# EAGLE schematic MCU board ATmega328p v1.4 (EAGLE 9.2.1)
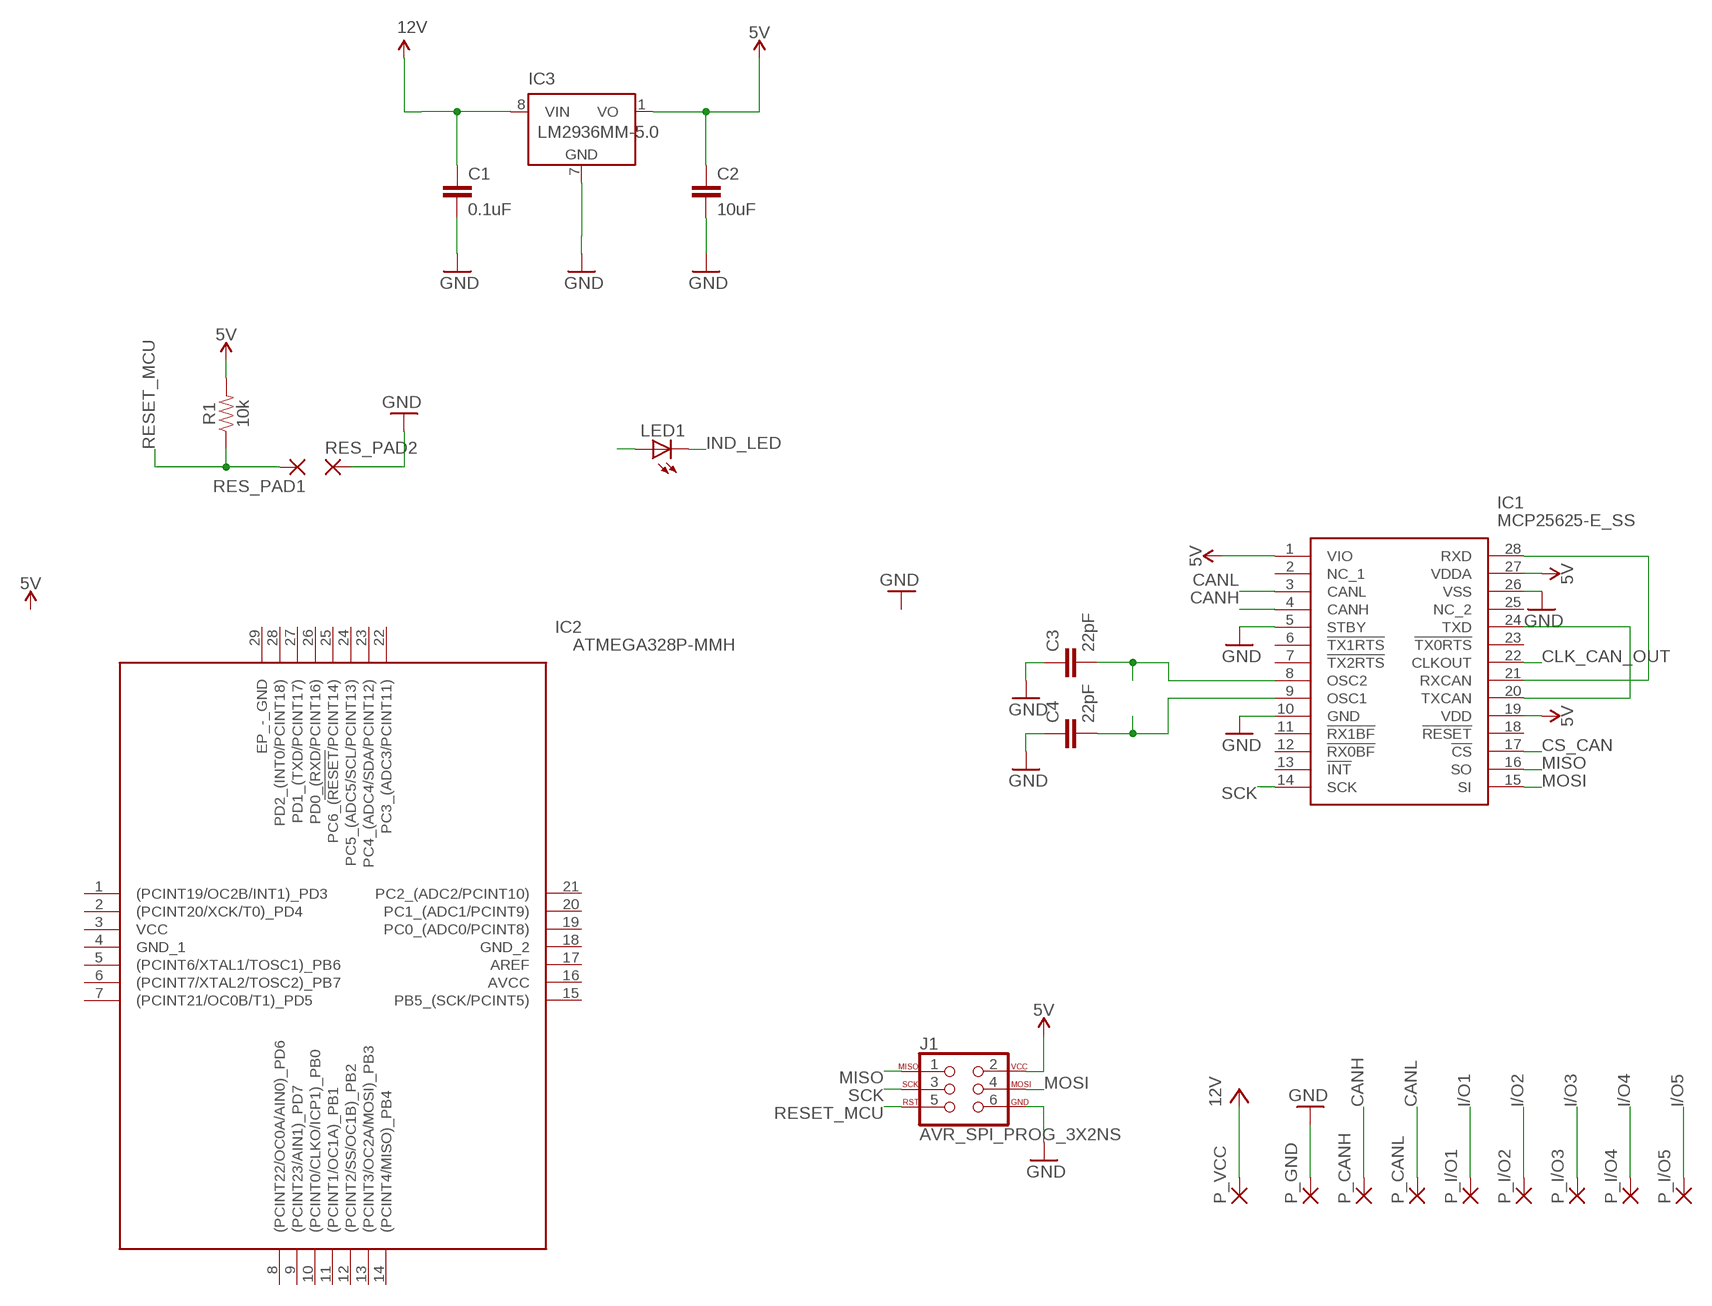
[diagram p0: schematic, sheet 1]

## Parts
C1  0.1uF  0.1UF-0402-16V-10%  [0402]
C2  10uF  10UF-0603-6.3V-20%  [0603]
C3  22pF  22PF-0603-50V-5%  [0603]
C4  22pF  22PF-0603-50V-5%  [0603]
IC1  MCP25625-E_SS  [SOP65P780X200-28N]
IC2  ATMEGA328P-MMH  [QFN45P400X400X100-29N]
IC3  LM2936MM-5.0  [MINI-SO8]
J1  AVR_SPI_PROG_3X2NS  [2X3-NS]
LED1  LED  [SMARTLED-TTW]
P_CANH  2,15/1,0  [2,15/1,0]
P_CANL  2,15/1,0  [2,15/1,0]
P_GND  2,15/1,0  [2,15/1,0]
P_I/O1  2,15/1,0  [2,15/1,0]
P_I/O2  2,15/1,0  [2,15/1,0]
P_I/O3  2,15/1,0  [2,15/1,0]
P_I/O4  2,15/1,0  [2,15/1,0]
P_I/O5  2,15/1,0  [2,15/1,0]
P_VCC  2,15/1,0  [2,15/1,0]
R1  10k  10KOHM-0603-1/10W-1%  [0603]
RES_PAD1  SMD2  [SMD1,27-2,54]
RES_PAD2  SMD2  [SMD1,27-2,54]

## Nets
5V: C2.1 IC1.1(VIO) IC1.19(VDD) IC1.27(VDDA) IC3.1(VO) J1.2 R1.2
12V: C1.1 IC3.8(VIN)
CANH: IC1.4(CANH) P_CANH.1(P)
CANL: IC1.3(CANL) P_CANL.1(P)
CLK_CAN_OUT: IC1.22(CLKOUT)
CS_CAN: IC1.17(!CS)
GND: C1.2 C2.2 C3.1 C4.1 IC1.5(STBY) IC1.10(GND) IC1.26(VSS) IC3.7(GND) J1.6 P_GND.1(P) RES_PAD2.1(P)
I/O1: P_I/O1.1(P)
I/O2: P_I/O2.1(P)
I/O3: P_I/O3.1(P)
I/O4: P_I/O4.1(P)
I/O5: P_I/O5.1(P)
IND_LED: LED1.C@1(C)
MISO: IC1.16(SO) J1.1
MOSI: IC1.15(SI) J1.4
N$1: C4.2 IC1.9(OSC1)
N$2: C3.2 IC1.8(OSC2)
N$3: IC1.21(RXCAN) IC1.28(RXD)
N$4: IC1.20(TXCAN) IC1.24(TXD)
N$5: LED1.A@1(A)
RESET_MCU: J1.5 R1.1 RES_PAD1.1(P)
SCK: IC1.14(SCK) J1.3
VCC: P_VCC.1(P) ; supply symbol labelled 12V
Unconnected: IC1.2(NC_1) IC1.6(!TX1RTS) IC1.7(!TX2RTS) IC1.11(!RX1BF) IC1.12(!RX0BF) IC1.13(!INT) IC1.18(!RESET) IC1.23(!TX0RTS) IC1.25(NC_2) IC2.1((PCINT19/OC2B/INT1)_PD3) IC2.2((PCINT20/XCK/T0)_PD4) IC2.3(VCC) IC2.4(GND_1) IC2.5((PCINT6/XTAL1/TOSC1)_PB6) IC2.6((PCINT7/XTAL2/TOSC2)_PB7) IC2.7((PCINT21/OC0B/T1)_PD5) IC2.8((PCINT22/OC0A/AIN0)_PD6) IC2.9((PCINT23/AIN1)_PD7) IC2.10((PCINT0/CLKO/ICP1)_PB0) IC2.11((PCINT1/OC1A)_PB1) IC2.12((PCINT2/SS/OC1B)_PB2) IC2.13((PCINT3/OC2A/MOSI)_PB3) IC2.14((PCINT4/MISO)_PB4) IC2.15(PB5_(SCK/PCINT5)) IC2.16(AVCC) IC2.17(AREF) IC2.18(GND_2) IC2.19(PC0_(ADC0/PCINT8)) IC2.20(PC1_(ADC1/PCINT9)) IC2.21(PC2_(ADC2/PCINT10)) IC2.22(PC3_(ADC3/PCINT11)) IC2.23(PC4_(ADC4/SDA/PCINT12)) IC2.24(PC5_(ADC5/SCL/PCINT13)) IC2.25(PC6_(!RESET!/PCINT14)) IC2.26(PD0_(RXD/PCINT16)) IC2.27(PD1_(TXD/PCINT17)) IC2.28(PD2_(INT0/PCINT18)) IC2.29(EP_-_GND)

## Library data of the parts
C1 = SparkFun-Capacitors:0.1UF: 0.1µF ceramic capacitors A capacitor is a passive two-terminal electrical component used to store electrical energy temporarily in an electric field.; PROD_ID: CAP-12416
C2 = SparkFun-Capacitors:10UF: 10.0µF ceramic capacitors A capacitor is a passive two-terminal electrical component used to store electrical energy temporarily in an electric field.; PROD_ID: CAP-11015
C3 C4 = SparkFun-Capacitors:22PF: 22pF ceramic capacitors A capacitor is a passive two-terminal electrical component used to store electrical energy temporarily in an electric field.; PROD_ID: CAP-07876
IC1 = MCP25625-E_SS:MCP25625-E_SS: CAN Controller with Transceiver SSOP28 Microchip MCP25625-E/SS, CAN Controller 1MBps CAN 2.0, 28-Pin SSOP Source: Datasheet <http://ww1.microchip.com/downloads/en/DeviceDoc/20005282B.pdf>; ALLIED_NUMBER: 70415903; ALLIED_PRICE-STOCK: https://www.alliedelec.com/microchip-technology-inc-mcp25625-e-ss/70415903/; ARROW_PART_NUMBER: MCP25625-E/SS; ARROW_PRICE-STOCK: https://www.arrow.com/en/products/mcp25625-ess/microchip-technology; DESCRIPTION: CAN Controller with Transceiver SSOP28 Microchip MCP25625-E/SS, CAN Controller 1MBps CAN 2.0, 28-Pin SSOP; HEIGHT: 2mm; MANUFACTURER_NAME: Microchip; MANUFACTURER_PART_NUMBER: MCP25625-E/SS; RS_PART_NUMBER: 1651935; RS_PRICE-STOCK: http://uk.rs-online.com/web/p/products/1651935
IC2 = ATMEGA328P-MMH:ATMEGA328P-MMH: Atmel ATMEGA328P-MMH, 8bit AVR Microcontroller, 20MHz, 32 kB Flash, 28-Pin QFN Source: Datasheet <http://uk.rs-online.com/web/p/products/8149138P>; ARROW_PART_NUMBER: ATMEGA328P-MMH; ARROW_PRICE-STOCK: https://www.arrow.com/en/products/atmega328p-mmh/microchip-technology; DESCRIPTION: Atmel ATMEGA328P-MMH, 8bit AVR Microcontroller, 20MHz, 32 kB Flash, 28-Pin QFN; HEIGHT: 1mm; MANUFACTURER_NAME: Microchip; MANUFACTURER_PART_NUMBER: ATMEGA328P-MMH; RS_PART_NUMBER: 1310272P; RS_PRICE-STOCK: http://uk.rs-online.com/web/p/products/1310272P
IC3 = national-semiconductor:LM2936?*: Ultra-Low Quiescent Current LDO Voltage Regulator Source: Data sheet <http://www.national.com/ds/LM/LM2936.pdf>; MF: NATIONAL SEMICONDUCTOR; MPN: LM2936MM-5.0/NOPB; OC_FARNELL: 1312707; OC_NEWARK: 41K4518
J1 = SparkFun-Connectors:AVR_SPI_PROG_3X2: AVR ISP 6 Pin This is the reduced ISP connector for AVR programming. Common on Arduino. This footprint will take up less PCB space and can be used with a 10-pin to 6-pin adapter such as SKU: BOB-08508 **Special note about "TEST_POINT" package. The stop mask is on the top side, so if you want your programming test points to be on the bottom of your board, make sure to place this package on the bottom side of the board. This also ensure that the orientation to program from the bottom side will be correct. SparkFun Products: SparkFun ISP Pogo Adapter <https://www.sparkfun.com/products/11591> - NS Tiny AVR Programmer <https://www.sparkfun.com/products/11801> -PTH
LED1 = led:LED: LED OSRAM: - CHIPLED LG R971, LG N971, LY N971, LG Q971, LY Q971, LO R971, LY R971 LH N974, LH R974 LS Q976, LO Q976, LY Q976 LO Q996 - Hyper CHIPLED LW Q18S LB Q993, LB Q99A, LB R99A - SideLED LS A670, LO A670, LY A670, LG A670, LP A670 LB A673, LV A673, LT A673, LW A673 LH A674 LY A675 LS A676, LA A676, LO A676, LY A676, LW A676 LS A679, LY A679, LG A679 - Hyper Micro SIDELED® LS Y876, LA Y876, LO Y876, LY Y876 LT Y87S - SmartLED LW L88C, LW L88S LB L89C, LB L89S, LG L890 LS L89K, LO L89K, LY L89K LS L896, LA L896, LO L896, LY L896 - TOPLED LS T670, LO T670, LY T670, LG T670, LP T670 LSG T670, LSP T670, LSY T670, LOP T670, LYG T670 LG T671, LOG T671, LSG T671 LB T673, LV T673, LT T673, LW T673 LH T674 LS T676, LA T676, LO T676, LY T676, LB T676, LH T676, LSB T676, LW T676 LB T67C, LV T67C, LT T67C, LS T67K, LO T67K, LY T67K, LW E67C LS E67B, LA E67B, LO E67B, LY E67B, LB E67C, LV E67C, LT E67C LW T67C LS T679, LY T679, LG T679 LS T770, LO T770, LY T770, LG T770, LP T770 LB T773, LV T773, LT T773, LW T773 LH T774 LS E675, LA E675, LY E675, LS T675 LS T776, LA T776, LO T776, LY T776, LB T776 LHGB T686 LT T68C, LB T68C - Hyper Mini TOPLED® LB M676 - Mini TOPLED Santana® LG M470 LS M47K, LO M47K, LY M47K Source: http://www.osram.convergy.de LUXEON: - LUMILED® LXK2-PW12-R00, LXK2-PW12-S00, LXK2-PW14-U00, LXK2-PW14-V00 LXK2-PM12-R00, LXK2-PM12-S00, LXK2-PM14-U00 LXK2-PE12-Q00, LXK2-PE12-R00, LXK2-PE12-S00, LXK2-PE14-T00, LXK2-PE14-U00 LXK2-PB12-K00, LXK2-PB12-L00, LXK2-PB12-M00, LXK2-PB14-N00, LXK2-PB14-P00, LXK2-PB14-Q00 LXK2-PR12-L00, LXK2-PR12-M00, LXK2-PR14-Q00, LXK2-PR14-R00 LXK2-PD12-Q00, LXK2-PD12-R00, LXK2-PD12-S00 LXK2-PH12-R00, LXK2-PH12-S00 LXK2-PL12-P00, LXK2-PL12-Q00, LXK2-PL12-R00 Source: www.luxeon.com KINGBRIGHT: KA-3528ASYC Source: www.kingbright.com
P_CANH P_CANL P_GND P_I/O1-P_I/O5 P_VCC = wirepad:2,15/1,0: THROUGH-HOLE PAD
R1 = SparkFun-Resistors:10KOHM: 10kΩ resistor A resistor is a passive two-terminal electrical component that implements electrical resistance as a circuit element. Resistors act to reduce current flow, and, at the same time, act to lower voltage levels within circuits. - Wikipedia; PROD_ID: RES-00824
RES_PAD1 RES_PAD2 = wirepad:SMD2: SMD PAD